# EAGLE design Simon (EAGLE 8.0.0)
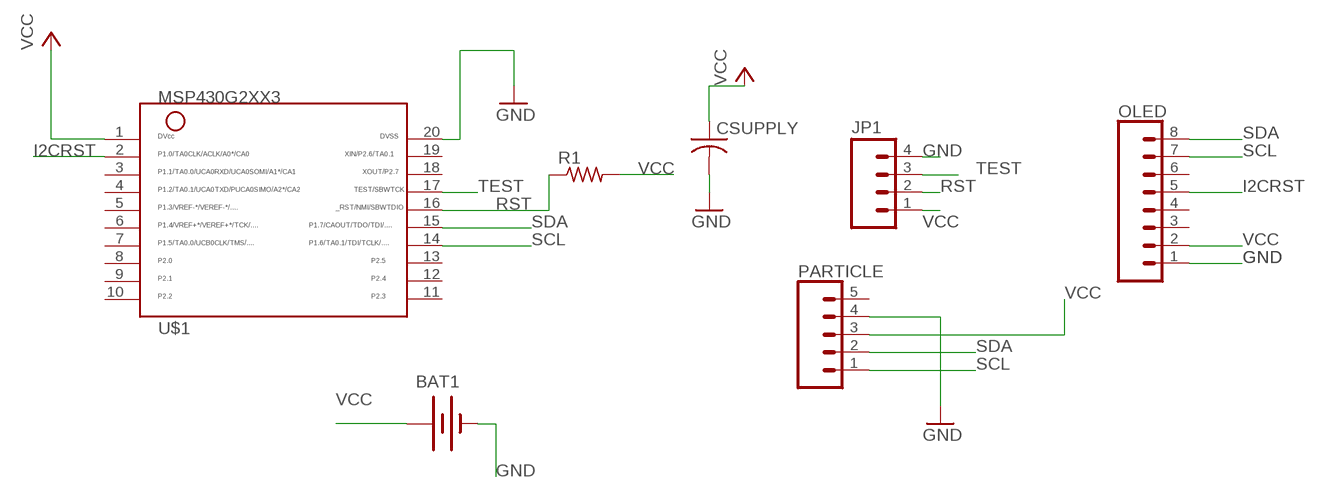
[diagram p0: schematic, sheet 1]

## Parts
BAT1  BATTERYBU2032SM  [BU2032SM]
CSUPPLY  C-USC1206  [C1206]
JP1  M04LOCK  [1X04_LOCK]
OLED  CONN_08"  [1X08]
PARTICLE  CONN_05  [1X05]
R1  R-US_R1206  [R1206]
U$1  MSP430G2XX3TSSOP  [PW20]

## Nets
GND: BAT1.P$2(-) CSUPPLY.2 JP1.4 OLED.1 PARTICLE.4 U$1.20
I2CRST: OLED.5 U$1.2
RST: JP1.2 R1.1 U$1.16
SCL: OLED.7 PARTICLE.1 U$1.14
SDA: OLED.8 PARTICLE.2 U$1.15
TEST: JP1.3 U$1.17
VCC: BAT1.P$1(+) CSUPPLY.1 JP1.1 OLED.2 PARTICLE.3 R1.2 U$1.1
Unconnected: OLED.3 OLED.4 OLED.6 PARTICLE.5 U$1.3 U$1.4 U$1.5 U$1.6 U$1.7 U$1.8 U$1.9 U$1.10 U$1.11 U$1.12 U$1.13 U$1.18 U$1.19

## Library data of the parts
BAT1 = ELEC327:BATTERY: Battery Holders Various common sizes : AA, AAA, 20mm coin cell and 12mm coin cell. 20MM_4LEGS, BATT-10373
CSUPPLY = rcl:C-US: CAPACITOR, American symbol
JP1 = SparkFun:M04: Header 4 Standard 4-pin 0.1" header. Use with straight break away headers (SKU : PRT-00116), right angle break away headers (PRT-00553), swiss pins (PRT-00743), machine pins (PRT-00117), and female headers (PRT-00115). Molex polarized connector foot print use with SKU : PRT-08231 with associated crimp pins and housings. 1MM SMD Version SKU: PRT-10208
OLED = SparkFun-Connectors:CONN_08: Multi connection point. Often used as Generic Header-pin footprint for 0.1 inch spaced/style header connections On any of the 0.1 inch spaced packages, you can populate with these: Break Away Headers - Straight <https://www.sparkfun.com/products/116> (PRT-00116) Break Away Male Headers - Right Angle <https://www.sparkfun.com/products/553> (PRT-00553) Female Headers <https://www.sparkfun.com/products/115> (PRT-00115) Break Away Headers - Machine Pin <https://www.sparkfun.com/products/117> (PRT-00117) Break Away Female Headers - Swiss Machine Pin <https://www.sparkfun.com/products/743> (PRT-00743) Arduino Stackable Header - 8 Pin <https://www.sparkfun.com/products/9279> (PRT-09279) For SCREWTERMINALS and SPRING TERMINALS visit here: Screw Terimnals on SparkFun.com <https://www.sparkfun.com/search/results?term=Screw+Terminals> (5mm/3.5mm/2.54mm spacing) This device is also useful as a general connection point to wire up your design to another part of your project. Our various solder wires solder well into these plated through hole pads. Hook-Up Wire - Assortment (Stranded, 22 AWG) <https://www.sparkfun.com/products/11375> (PRT-11375) Hook-Up Wire - Assortment (Solid Core, 22 AWG) <https://www.sparkfun.com/products/11367> (PRT-11367) View the entire wire category on our website here <https://www.sparkfun.com/categories/141> Special notes: Molex polarized connector foot print use with SKU : PRT-08231 with associated crimp pins and housings. 1MM SMD Version SKU: PRT-10208 NOTES ON THE VARIANTS LOCK and LOCK_LONGPADS... This footprint was designed to help hold the alignment of a through-hole component (i.e. 6-pin header) while soldering it into place. You may notice that each hole has been shifted either up or down by 0.005 of an inch from it's more standard position (which is a perfectly straight line). This slight alteration caused the pins (the squares in the middle) to touch the edges of the holes. Because they are alternating, it causes a "brace" to hold the component in place. 0.005 has proven to be the perfect amount of "off-center" position when using our standard breakaway headers. Although looks a little odd when you look at the bare footprint, once you have a header in there, the alteration is very hard to notice. Also,if you push a header all the way into place, it is covered up entirely on the bottom side.; PROD_ID: CONN-08438
PARTICLE = SparkFun-Connectors:CONN_05: Multi connection point. Often used as Generic Header-pin footprint for 0.1 inch spaced/style header connections On any of the 0.1 inch spaced packages, you can populate with these: Break Away Headers - Straight <https://www.sparkfun.com/products/116> (PRT-00116) Break Away Male Headers - Right Angle <https://www.sparkfun.com/products/553> (PRT-00553) Female Headers <https://www.sparkfun.com/products/115> (PRT-00115) Break Away Headers - Machine Pin <https://www.sparkfun.com/products/117> (PRT-00117) Break Away Female Headers - Swiss Machine Pin <https://www.sparkfun.com/products/743> (PRT-00743) For SCREWTERMINALS and SPRING TERMINALS visit here: Screw Terimnals on SparkFun.com <https://www.sparkfun.com/search/results?term=Screw+Terminals> (5mm/3.5mm/2.54mm spacing) This device is also useful as a general connection point to wire up your design to another part of your project. Our various solder wires solder well into these plated through hole pads. Hook-Up Wire - Assortment (Stranded, 22 AWG) <https://www.sparkfun.com/products/11375> (PRT-11375) Hook-Up Wire - Assortment (Solid Core, 22 AWG) <https://www.sparkfun.com/products/11367> (PRT-11367) View the entire wire category on our website here <https://www.sparkfun.com/categories/141> Special notes: Molex polarized connector foot print use with SKU : PRT-08231 with associated crimp pins and housings. 1MM SMD Version SKU: PRT-10208
R1 = resistor:R-US_: RESISTOR, American symbol
U$1 = ELEC327:MSP430G2XX3: MSP430G2XX3 PDIP (N) 20 Pin Package

## Board
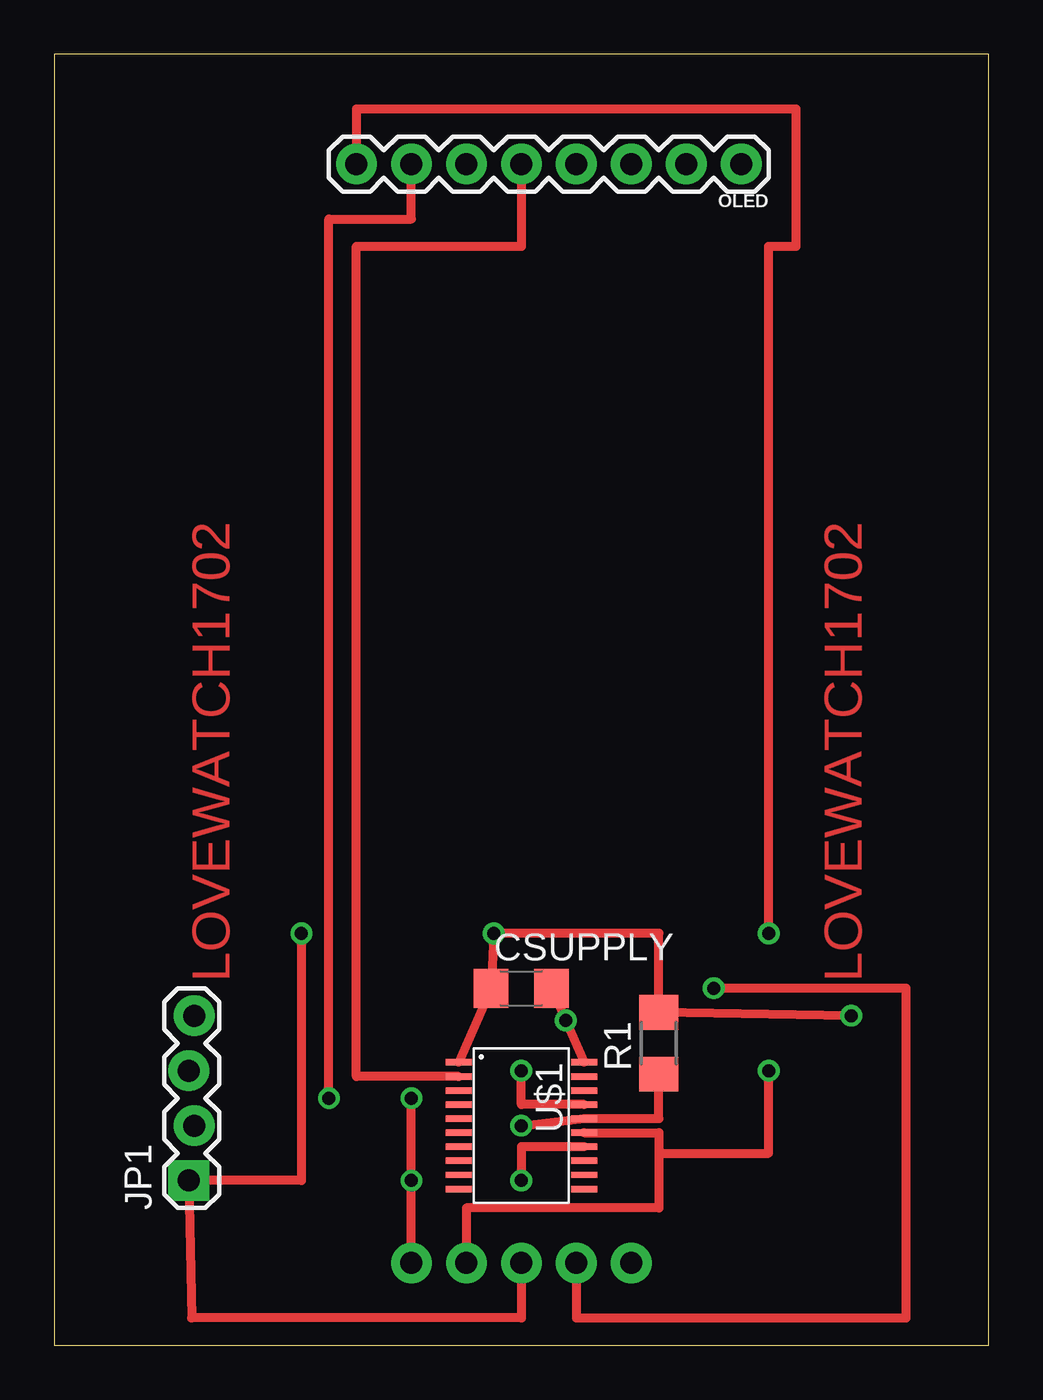
[diagram p1: board, top side]
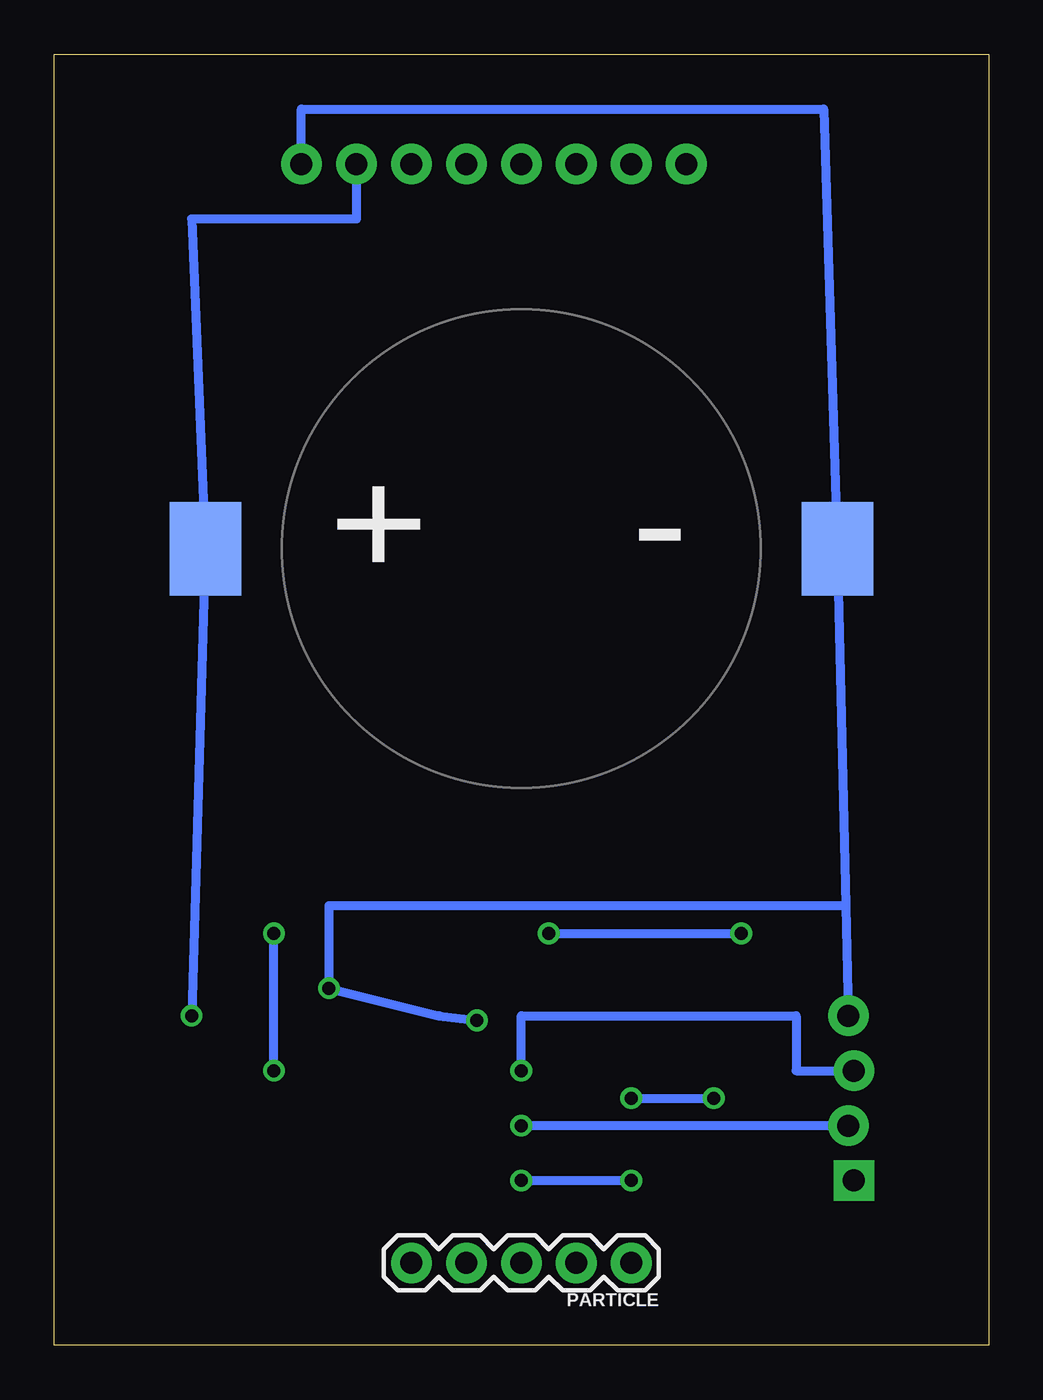
[diagram p2: board, bottom side, seen from below]

Size 43.18 x 59.69 mm. Coordinates in mm from the lower left corner, seen from the top.
Outline: 0,0 43.18,0 43.18,59.69 0,59.69 0,0
Copper layers (1*16): Top 0.035mm / dielectric 1.5mm / Bottom 0.035mm
Design rules "default *": minimum track width 16mil, minimum drill 24mil, track to track 10mil, track to pad 10mil, pad to pad 8mil, via to via 8mil, smd to smd 8mil, copper to edge 40mil, drill to drill 8mil, minimum pad ring 10mil, minimum via ring 8mil, stop-mask expansion 4mil, vias tented up to drill 0mil, thermal gap 10mil

### Footprints (pad centres in the part's own frame; a part is rotated, then mirrored left to right if it is on the bottom)
BU2032SM = smd 3.302 x 4.318: P$1 -14.605,0; P$2 14.605,0
C1206 = smd 1.6 x 1.8: 1 -1.4,0; 2 1.4,0
1X04_LOCK = drill 1.016 pad 1.88 square: 1 0,0.127 | drill 1.016 pad 1.88: 2 2.54,-0.127; 3 5.08,0.127; 4 7.62,-0.127
1X08 = drill 1.016 pad 1.88: 1 0,0; 2 2.54,0; 3 5.08,0; 4 7.62,0; 5 10.16,0; 6 12.7,0; 7 15.24,0; 8 17.78,0
1X05 = drill 1.016 pad 1.88: 1 0,0; 2 2.54,0; 3 5.08,0; 4 7.62,0; 5 10.16,0
R1206 = smd 1.6 x 1.803: 1 -1.422,0; 2 1.422,0
PW20 = smd 0.3 x 1.2: 1 -2.925,-2.9; 2 -2.275,-2.9; 3 -1.625,-2.9; 4 -0.975,-2.9; 5 -0.325,-2.9; 6 0.325,-2.9; 7 0.975,-2.9; 8 1.625,-2.9; 9 2.275,-2.9; 10 2.925,-2.9; 11 2.925,2.9; 12 2.275,2.9; 13 1.625,2.9; 14 0.975,2.9; 15 0.325,2.9; 16 -0.325,2.9; 17 -0.975,2.9; 18 -1.625,2.9; 19 -2.275,2.9; 20 -2.925,2.9

### Placement (x,y rotation side)
BAT1  21.59,36.83 0 bottom
CSUPPLY  21.59,16.51 0 top
JP1  6.35,7.62 90 top
OLED  31.75,54.61 180 top
PARTICLE  16.51,3.81 180 bottom
R1  27.94,13.97 90 top
U$1  21.59,10.16 270 top

### Tracks (layer width: path | path; a pad name or v marks a point on that pad's centre or on a via)
GND  (via drill 0.6)
  Top 0.406: CSUPPLY.2 v23.64,15.03 U$1.20 | PARTICLE.4 24.13,1.27 39.37,1.27 39.37,16.51 v30.48,16.51
  Bottom 0.406: OLED.1 31.75,57.15 7.62,57.15 BAT1.P$2 6.6,20.31 | v23.64,15.03 25.4,15.24 v30.48,16.51 30.48,20.32 6.6,20.31 | 6.6,20.31 JP1.4
I2CRST
  Top 0.406: OLED.5 21.59,50.8 13.97,50.8 13.97,12.44 U$1.2
RST  (via drill 0.6)
  Top 0.406: v21.59,10.16 U$1.16 27.94,10.48 R1.1
  Bottom 0.406: JP1.2 v21.59,10.16
SCL  (via drill 0.6)
  Top 0.406: PARTICLE.1 v16.51,7.62 v16.51,11.43 | OLED.7 16.51,52.07 12.7,52.07 v12.7,11.43 | U$1.14 21.59,9.19 v21.59,7.62
  Bottom 0.406: v16.51,11.43 v12.7,11.43 | v21.59,7.62 v16.51,7.62
SDA  (via drill 0.6)
  Top 0.406: U$1.15 27.94,9.84 27.94,8.91 | 27.94,8.91 27.94,6.35 19.05,6.35 PARTICLE.2 | 27.94,8.89 28.07,8.89 | 28.07,8.89 33.02,8.89 v33.02,12.7 | v33.02,19.05 33.02,50.8 34.29,50.8 34.29,57.15 13.97,57.15 OLED.8 | 27.94,8.91 28.07,8.91 28.07,8.89
  Bottom 0.406: v33.02,12.7 v33.02,19.05
TEST  (via drill 0.6)
  Top 0.406: U$1.17 21.59,11.13 v21.59,12.7
  Bottom 0.406: v21.59,12.7 21.59,15.24 8.89,15.24 8.89,12.7 JP1.3
VCC  (via drill 0.6)
  Top 0.406: v36.83,15.24 R1.2 27.94,19.05 v20.32,19.05 CSUPPLY.1 U$1.1 | PARTICLE.3 21.59,1.27 6.35,1.27 JP1.1 11.43,7.62 v11.43,19.05
  Bottom 0.406: OLED.2 29.21,52.07 36.83,52.07 BAT1.P$1 v36.83,15.24 | v20.32,19.05 v11.43,19.05

### Text on the board
Top: LOVEWATCH1702 | LOVEWATCH1702